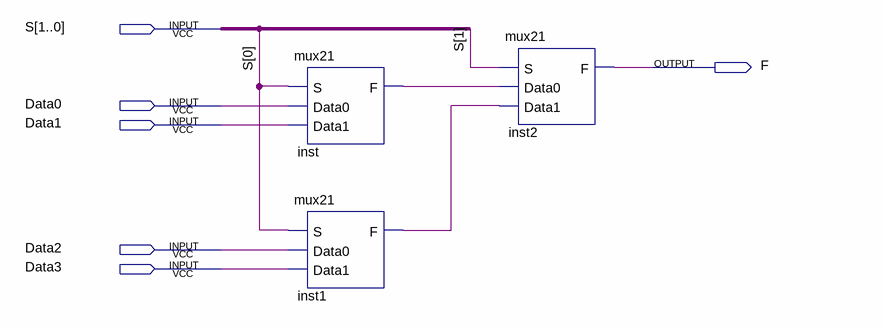
[diagram p0: schematic sheet]
// Quartus schematic mux41.bdf as structural Verilog: 3 symbols, 6 pins
module mux41 (
  input  [1:0] S,
  input  Data0,
  input  Data1,
  input  Data2,
  input  Data3,
  output F
);

  wire inst1_f, inst_f;

  mux21 inst (.S(S[0]), .Data0(Data0), .Data1(Data1), .F(inst_f));
  mux21 inst1 (.S(S[0]), .Data0(Data2), .Data1(Data3), .F(inst1_f));
  mux21 inst2 (.S(S[1]), .Data0(inst_f), .Data1(inst1_f), .F(F));
endmodule
